# Altium schematic sheet Synch_Demod.SchDoc
size OrCAD A
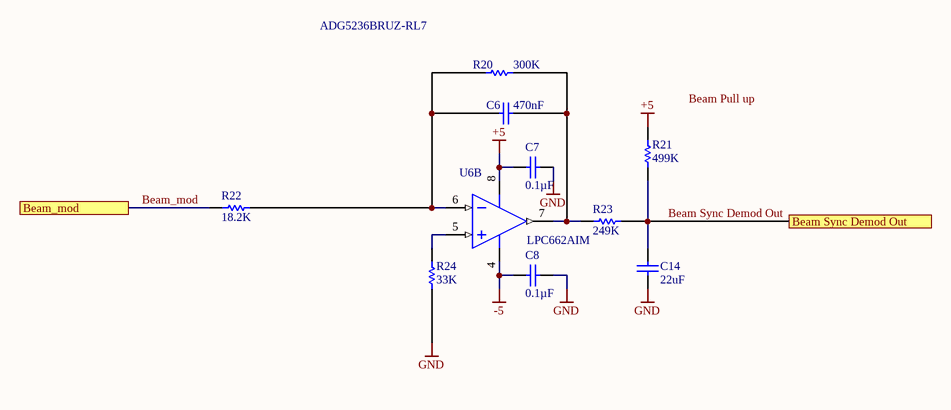
[diagram p0: Synch_Demod.SchDoc]

## Parts
C6  470nF  [CAPC0805(2012)75_L]
C7  Capacitance: 0.1µF  [CAPC0805(2012)145_N]  (hidden comment: CAP CER 0.1UF 25V X7R 0805)
C8  Capacitance: 0.1µF  [CAPC0805(2012)145_N]  (hidden comment: CAP CER 0.1UF 25V X7R 0805)
C14  22uF  [CAPC0805(2012)75_L]
R20  300K  [RESC0805(2012)_L]
R21  499K  [RESC0805(2012)_L]
R22  18.2K  [RESC0805(2012)_L]
R23  249K  [RESC0805(2012)_L]
R24  33K  [RESC0805(2012)_L]
U6  LPC662AIM  [D0008A_M]  (part B of 2)

## Ports
Beam Sync Demod Out, Beam_mod

## Nets
+5: C7.1 R21.2 U6.8(V+)
-5: C8.1 U6.4(V-)
GND: C7.2 C8.2 C14.1 R24.1
Beam Sync Demod Out: C14.2 R21.1 R23.1 ; port Beam Sync Demod Out
Beam_mod: R22.2 ; port Beam_mod
NetC6_1: C6.1 R20.2 R22.1 U6.6(INB-)
NetC6_2: C6.2 R20.1 R23.2 U6.7(OUTB)
NetR24_2: R24.2 U6.5(INB+)

## Notes on the sheet
- ADG5236BRUZ-RL7
- Labels drawn without touching a wire or pin: Beam Pull up
- Title
- Size:
- Date:
- Orcad A
- Number:
- Time:
- Revision:
- Sheet
- of
- ZLS Corporation
- 7801 North Lamar Blvd.
- Suite E-184
- Austin, Texas 78752  USA
- (512) 453-0288
- File:

## Library data of the parts
C6 = CMP-1036-02117-1: CAP CER 0.47UF 25V X7R 0805; Manufacturer: Murata Electronics North America; Manufacturer Part Number: GRM219R71E474KA88D; Tolerance: ±10%; Supplier 1: Digi-Key; Supplier Part Number 1: 490-11584-1-ND; RoHS: RoHS Compliant; Category: Capacitors; Stock 1: 410; Pricing 1: 1=0.38, 10=0.262, 100=0.1573, 500=0.118, 1000=0.09964 (USD); Packaging: Cut Tape (CT); Part Status: Active; Voltage - Rated: 25V; Temperature Coefficient: X7R; Operating Temperature: -55°C ~ 125°C; Features: -; Ratings: -; Applications: General Purpose; Mounting Type: Surface Mount, MLCC; Package / Case: 0805 (2012 Metric); Size / Dimension: 0.079" L x 0.049" W (2.00mm x 1.25mm); Height - Seated (Max): -; Thickness (Max): 0.037" (0.95mm); Lead Spacing: -; Lead Style: -; ComponentLink1URL: https://www.murata.com/~/media/webrenewal/support/library/catalog/products/capacitor/mlcc/c02e.ashx?la=en-us; ComponentLink1Description: https://www.murata.com/~/media/webrenewal/support/library/catalog/products/capacitor/mlcc/c02e.ashx?la=en-us
C7 C8 = CMP-1036-04795-1: Manufacturer: Murata Electronics North America; Manufacturer Part Number: GRM21BR71E104KA01L; Tolerance: ±10%; Supplier 1: Digi-Key; Supplier Part Number 1: 490-1673-6-ND; RoHS: RoHS Compliant; Category: Capacitors; Stock 1: 891652; Pricing 1: 1=0.2, 10=0.145, 100=0.0683, 500=0.04788, 1000=0.03964 (USD); Packaging: Digi-Reel®; Part Status: Active; Voltage - Rated: 25V; Temperature Coefficient: X7R; Operating Temperature: -55°C ~ 125°C; Features: -; Ratings: -; Applications: General Purpose; Mounting Type: Surface Mount, MLCC; Package / Case: 0805 (2012 Metric); Size / Dimension: 0.079" L x 0.049" W (2.00mm x 1.25mm); Height - Seated (Max): -; Thickness (Max): 0.053" (1.35mm); Lead Spacing: -; Lead Style: -; ComponentLink1URL: http://www.murata.com/~/media/webrenewal/support/library/catalog/products/capacitor/mlcc/c02e.ashx; ComponentLink1Description: http://www.murata.com/~/media/webrenewal/support/library/catalog/products/capacitor/mlcc/c02e.ashx
C14 = CMP-1036-02117-1: CAP CER 22UF 25V X5R 0805; Manufacturer: Murata Electronics North America; Manufacturer Part Number: GRM21BR61E226ME44L; Tolerance: ±20%; Notification: Current market demand for these product types have resulted in fluctuating and extending lead times. Lead times may differ.; Supplier 1: Digi-Key; Supplier Part Number 1: 490-10749-1-ND; RoHS: RoHS Compliant; Category: Capacitors; Stock 1: 2004; Pricing 1: 1=0.57, 10=0.404, 100=0.2663, 500=0.19722, 1000=0.16764 (USD); Packaging: Cut Tape (CT); Part Status: Active; Voltage - Rated: 25V; Temperature Coefficient: X5R; Operating Temperature: -55°C ~ 85°C; Features: -; Ratings: -; Applications: General Purpose; Mounting Type: Surface Mount, MLCC; Package / Case: 0805 (2012 Metric); Size / Dimension: 0.079" L x 0.049" W (2.00mm x 1.25mm); Height - Seated (Max): -; Thickness (Max): 0.057" (1.45mm); Lead Spacing: -; Lead Style: -; ComponentLink1URL: http://search.murata.co.jp/Ceramy/image/img/A01X/G101/ENG/GRM21BR61E226ME44-01.pdf; ComponentLink1Description: http://search.murata.co.jp/Ceramy/image/img/A01X/G101/ENG/GRM21BR61E226ME44-01.pdf
R20 = CMP-1013-00215-1: RES SMD 300K OHM 1% 1/8W 0805; Manufacturer: Vishay Dale; Manufacturer Part Number: CRCW0805300KFKEAHP; Power (Watts): 0.5W, 1/2W; Temperature Coefficient: ±100ppm/°C; Supplier 1: Digi-Key; Supplier Part Number 1: 541-300KTCT-ND; RoHS: RoHS Compliant; Category: Resistors; Stock 1: 3851; Pricing 1: 1=0.28, 10=0.233, 100=0.0911, 1000=0.03812, 2500=0.03494 (USD); Packaging: Cut Tape (CT); Part Status: Active; Tolerance: ±1%; Composition: Thick Film; Features: Automotive AEC-Q200, Pulse Withstanding; Operating Temperature: -55°C ~ 155°C; Package / Case: 0805 (2012 Metric); Supplier Device Package: 0805; Size / Dimension: 0.079" L x 0.049" W (2.00mm x 1.25mm); Height - Seated (Max): 0.020" (0.50mm); Failure Rate: -; ComponentLink1URL: http://www.vishay.com/docs/20043/crcwhpe3.pdf; ComponentLink1Description: http://www.vishay.com/docs/20043/crcwhpe3.pdf
R21 = CMP-1013-00215-1: RES SMD 499K OHM 0.1% 1/8W 0805; Manufacturer: Panasonic Electronic Components; Manufacturer Part Number: ERA-6AEB4993V; Power (Watts): 0.125W, 1/8W; Temperature Coefficient: ±25ppm/°C; Supplier 1: Digi-Key; Supplier Part Number 1: P499KDACT-ND; RoHS: RoHS Compliant; Category: Resistors; Stock 1: 125602; Pricing 1: 1=0.36, 10=0.302, 100=0.1182, 1000=0.04948, 2500=0.04536 (USD); Packaging: Cut Tape (CT); Part Status: Active; Tolerance: ±0.1%; Composition: Thin Film; Features: Automotive AEC-Q200; Operating Temperature: -55°C ~ 155°C; Package / Case: 0805 (2012 Metric); Supplier Device Package: 0805; Size / Dimension: 0.079" L x 0.049" W (2.00mm x 1.25mm); Height - Seated (Max): 0.024" (0.60mm); Failure Rate: -; ComponentLink1URL: https://industrial.panasonic.com/cdbs/www-data/pdf/RDM0000/AOA0000C307.pdf; ComponentLink1Description: https://industrial.panasonic.com/cdbs/www-data/pdf/RDM0000/AOA0000C307.pdf
R22 = CMP-1013-00215-1: RES SMD 18.2K OHM 1% 1/8W 0805; Manufacturer: Panasonic Electronic Components; Manufacturer Part Number: ERJ-6ENF1822V; Power (Watts): 0.125W, 1/8W; Temperature Coefficient: ±100ppm/°C; Supplier 1: Digi-Key; Supplier Part Number 1: P18.2KCCT-ND; RoHS: RoHS Compliant; Category: Resistors; Stock 1: 116820; Pricing 1: 1=0.1, 10=0.079, 100=0.0305, 1000=0.0134, 2500=0.01157 (USD); Packaging: Cut Tape (CT); Part Status: Active; Tolerance: ±1%; Composition: Thick Film; Features: Automotive AEC-Q200; Operating Temperature: -55°C ~ 155°C; Package / Case: 0805 (2012 Metric); Supplier Device Package: 0805; Size / Dimension: 0.079" L x 0.049" W (2.00mm x 1.25mm); Height - Seated (Max): 0.028" (0.70mm); Failure Rate: -; ComponentLink1URL: https://industrial.panasonic.com/cdbs/www-data/pdf/RDA0000/AOA0000C304.pdf; ComponentLink1Description: https://industrial.panasonic.com/cdbs/www-data/pdf/RDA0000/AOA0000C304.pdf
R23 = CMP-1013-00215-1: RES SMD 249K OHM 0.1% 1/8W 0805; Manufacturer: Panasonic Electronic Components; Manufacturer Part Number: ERA-6AEB2493V; Power (Watts): 0.125W, 1/8W; Temperature Coefficient: ±25ppm/°C; Supplier 1: Digi-Key; Supplier Part Number 1: P249KDACT-ND; RoHS: RoHS Compliant; Category: Resistors; Stock 1: 18568; Pricing 1: 1=0.36, 10=0.302, 100=0.1182, 1000=0.04948, 2500=0.04536 (USD); Packaging: Cut Tape (CT); Part Status: Active; Tolerance: ±0.1%; Composition: Thin Film; Features: Automotive AEC-Q200; Operating Temperature: -55°C ~ 155°C; Package / Case: 0805 (2012 Metric); Supplier Device Package: 0805; Size / Dimension: 0.079" L x 0.049" W (2.00mm x 1.25mm); Height - Seated (Max): 0.024" (0.60mm); Failure Rate: -; ComponentLink1URL: https://industrial.panasonic.com/cdbs/www-data/pdf/RDM0000/AOA0000C307.pdf; ComponentLink1Description: https://industrial.panasonic.com/cdbs/www-data/pdf/RDM0000/AOA0000C307.pdf
R24 = CMP-1013-00215-1: RES SMD 33K OHM 1% 1/2W 0805; Manufacturer: Vishay Dale; Manufacturer Part Number: CRCW080533K0FKEAHP; Power (Watts): 0.5W, 1/2W; Temperature Coefficient: ±100ppm/°C; Supplier 1: Digi-Key; Supplier Part Number 1: 541-33.0KTCT-ND; RoHS: RoHS Compliant; Category: Resistors; Stock 1: 2026; Pricing 1: 1=0.28, 10=0.233, 100=0.0911, 1000=0.03812, 2500=0.03494 (USD); Packaging: Cut Tape (CT); Part Status: Active; Tolerance: ±1%; Composition: Thick Film; Features: Automotive AEC-Q200, Pulse Withstanding; Operating Temperature: -55°C ~ 155°C; Package / Case: 0805 (2012 Metric); Supplier Device Package: 0805; Size / Dimension: 0.079" L x 0.049" W (2.00mm x 1.25mm); Height - Seated (Max): 0.020" (0.50mm); Failure Rate: -; ComponentLink1URL: http://www.vishay.com/docs/20043/crcwhpe3.pdf; ComponentLink1Description: http://www.vishay.com/docs/20043/crcwhpe3.pdf
U6 = CMP-0055-00867-3: Low Power CMOS Dual Operational Amplifier, 8-pin Narrow SOIC; Manufacturer: Texas Instruments; Manufacturer Part Number: LPC662AIM/NOPB; Amplifier Type: General Purpose; Output Type: Rail-to-Rail; Slew Rate: 0.11 V/µs; Current - Supply: 86µA; Voltage - Supply, Single/Dual (±): 4.75 V ~ 15.5 V, ±2.38 V ~ 7.75 V; Supplier 1: Digi-Key; Supplier Part Number 1: LPC662AIM/NOPB-ND; RoHS: RoHS Compliant; Category: Integrated Circuits (ICs); Stock 1: 319; Pricing 1: 1=3.4, 95=2.88905, 190=2.50379, 570=2.13144, 1045=1.7976 (USD); Packaging: Tube; Part Status: Active; Operating Temperature: -40°C ~ 85°C; Mounting Type: Surface Mount; Package / Case: 8-SOIC (0.154", 3.90mm Width); Supplier Device Package: 8-SOIC; Base Part Number: LPC662; ComponentLink1URL: http://www.ti.com/lit/ds/symlink/lpc662.pdf; ComponentLink1Description: http://www.ti.com/lit/ds/symlink/lpc662.pdf